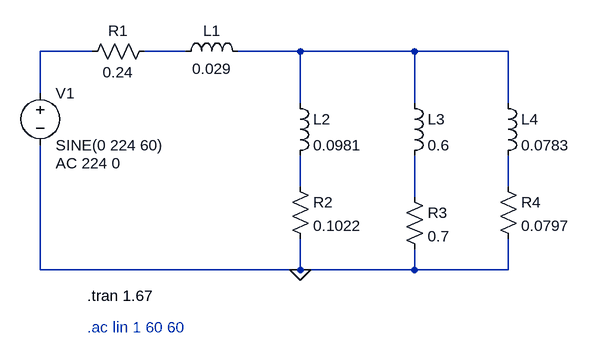
[diagram p0: schematic MARCOS_ANTONIO_TOME_OLIVEIRA2.asc]
MARCOS_ANTONIO_TOME_OLIVEIRA2.asc, the LTspice schematic file:
Version 4.1
SHEET 1 776 424
WIRE 32 -16 -48 -16
WIRE 176 -16 112 -16
WIRE 352 -16 256 -16
WIRE 528 -16 352 -16
WIRE 672 -16 528 -16
WIRE -48 48 -48 -16
WIRE 352 64 352 -16
WIRE 528 64 528 -16
WIRE 672 64 672 -16
WIRE 352 192 352 144
WIRE 672 192 672 144
WIRE 528 208 528 144
WIRE -48 320 -48 128
WIRE 352 320 352 272
WIRE 352 320 -48 320
WIRE 528 320 528 288
WIRE 528 320 352 320
WIRE 672 320 672 272
WIRE 672 320 528 320
FLAG 352 320 0
SYMBOL voltage -48 32 R0
WINDOW 123 24 124 Left 2
WINDOW 39 0 0 Left 0
SYMATTR InstName V1
SYMATTR Value SINE(0 224 60)
SYMATTR Value2 AC 224 0
SYMBOL res 128 -32 R90
WINDOW 0 0 56 VBottom 2
WINDOW 3 32 56 VTop 2
SYMATTR InstName R1
SYMATTR Value 0.24
SYMBOL ind 160 0 R270
WINDOW 0 32 56 VTop 2
WINDOW 3 5 56 VBottom 2
SYMATTR InstName L1
SYMATTR Value 0.029
SYMBOL ind 336 48 R0
SYMATTR InstName L2
SYMATTR Value 0.0981
SYMBOL res 336 176 R0
SYMATTR InstName R2
SYMATTR Value 0.1022
SYMBOL res 512 192 R0
SYMATTR InstName R3
SYMATTR Value 0.7
SYMBOL ind 512 48 R0
SYMATTR InstName L3
SYMATTR Value 0.6
SYMBOL ind 656 48 R0
SYMATTR InstName L4
SYMATTR Value 0.0783
SYMBOL res 656 176 R0
SYMATTR InstName R4
SYMATTR Value 0.0797
TEXT 24 360 Left 2 !.tran 1.67
TEXT 24 408 Left 2 ;.ac lin 1 60 60

The netlist it stands for:
* MARCOS_ANTONIO_TOME_OLIVEIRA2.asc
V1 N001 0 SINE(0 224 60) AC 224 0
R1 N002 N001 0.24
L1 N002 N003 0.029
L2 N003 N004 0.0981
R2 N004 0 0.1022
R3 N006 0 0.7
L3 N003 N006 0.6
L4 N003 N005 0.0783
R4 N005 0 0.0797
.tran 1.67
* .ac lin 1 60 60
.backanno
.end